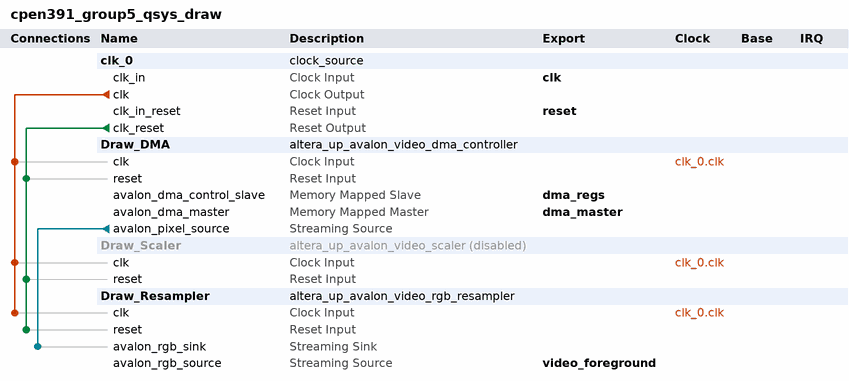
[diagram p0: system contents]
# Platform Designer (Qsys) system cpen391_group5_qsys_draw, Cyclone V 5CSEMA5F31C6
# Parameters at their usual value, and those the tool derives, are not listed.
package require -exact qsys 15.0
create_system cpen391_group5_qsys_draw
set_project_property DEVICE_FAMILY {Cyclone V}
set_project_property DEVICE 5CSEMA5F31C6

add_instance clk_0 clock_source 15.0
set_instance_parameter_value clk_0 clockFrequency 50000000

add_instance Draw_DMA altera_up_avalon_video_dma_controller 15.0
set_instance_parameter_value Draw_DMA addr_mode Consecutive
set_instance_parameter_value Draw_DMA back_start_address 0
set_instance_parameter_value Draw_DMA color_bits 8
set_instance_parameter_value Draw_DMA color_planes 4
set_instance_parameter_value Draw_DMA dma_enabled false
set_instance_parameter_value Draw_DMA height 480
set_instance_parameter_value Draw_DMA mode {From Memory to Stream}
set_instance_parameter_value Draw_DMA start_address 0
set_instance_parameter_value Draw_DMA width 640

add_instance Draw_Scaler altera_up_avalon_video_scaler 15.0
set_instance_property Draw_Scaler ENABLED false
set_instance_parameter_value Draw_Scaler color_bits 4
set_instance_parameter_value Draw_Scaler color_planes 4
set_instance_parameter_value Draw_Scaler height_in 120
set_instance_parameter_value Draw_Scaler height_scaling 4
set_instance_parameter_value Draw_Scaler width_in 160
set_instance_parameter_value Draw_Scaler width_scaling 4

add_instance Draw_Resampler altera_up_avalon_video_rgb_resampler 15.0
set_instance_parameter_value Draw_Resampler alpha 1023
set_instance_parameter_value Draw_Resampler input_type {32-bit RGBA}
set_instance_parameter_value Draw_Resampler output_type {40-bit RGBA}

# connections
add_connection clk_0.clk Draw_DMA.clk clock
add_connection clk_0.clk Draw_Resampler.clk clock
add_connection clk_0.clk Draw_Scaler.clk clock
add_connection clk_0.clk_reset Draw_DMA.reset reset
add_connection clk_0.clk_reset Draw_Resampler.reset reset
add_connection clk_0.clk_reset Draw_Scaler.reset reset
add_connection Draw_DMA.avalon_pixel_source Draw_Resampler.avalon_rgb_sink avalon_streaming

# exported interfaces
add_interface clk clock sink
set_interface_property clk EXPORT_OF clk_0.clk_in
add_interface dma_master avalon master
set_interface_property dma_master EXPORT_OF Draw_DMA.avalon_dma_master
add_interface dma_regs avalon slave
set_interface_property dma_regs EXPORT_OF Draw_DMA.avalon_dma_control_slave
add_interface reset reset sink
set_interface_property reset EXPORT_OF clk_0.clk_in_reset
add_interface video_foreground avalon_streaming source
set_interface_property video_foreground EXPORT_OF Draw_Resampler.avalon_rgb_source

set_interconnect_requirement {$system} qsys_mm.clockCrossingAdapter HANDSHAKE
set_interconnect_requirement {$system} qsys_mm.enableEccProtection FALSE
set_interconnect_requirement {$system} qsys_mm.insertDefaultSlave FALSE
set_interconnect_requirement {$system} qsys_mm.maxAdditionalLatency 1

save_system cpen391_group5_qsys_draw.qsys
